# Altium schematic sheet Vertap_IMU.SchDoc: IMU
size A4; Author: Taim Al-Dabbagh; DrawnBy: Taim Al-Dabbagh; Revision: v1; SheetNumber: 3; SheetTotal: 6
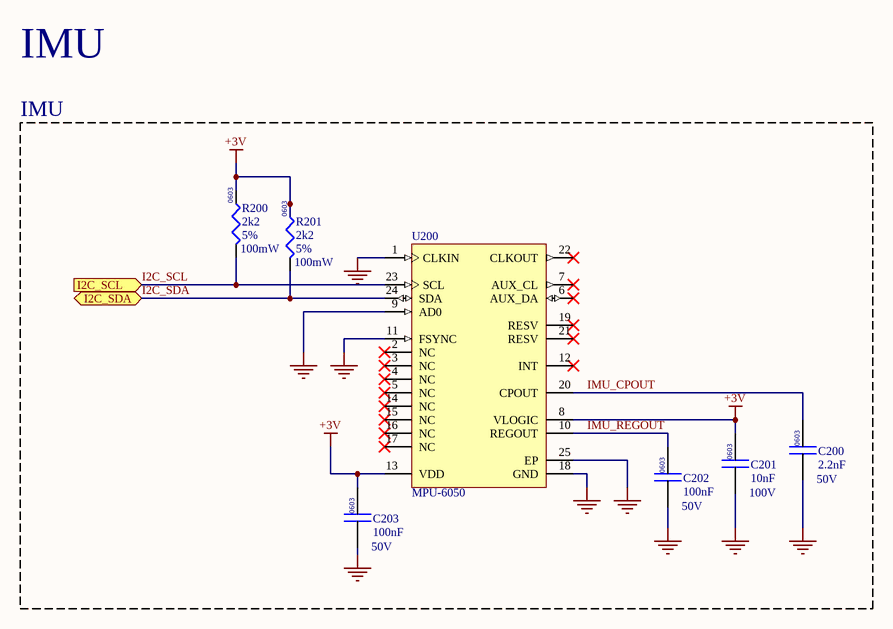
[diagram p0: Vertap_IMU.SchDoc]

## Parts
C200  2.2nF  [CAP_0603_MURATA]
C201  10nF  [CAP_0603_MURATA]
C202  100nF  [CAP_0603_MURATA]
C203  100nF  [CAP_0603_MURATA]
R200  2k2  [RES_0603_YAGEO]
R201  2k2  [RES_0603_YAGEO]
U200  MPU-6050  [IS-QFN-24_V]

## Ports
I2C_SCL (in), I2C_SDA (bidir)

## Nets
+3V: C201.1 C203.1 R200.1 R201.1 U200.8(VLOGIC) U200.13(VDD)
GND: C200.2 C201.2 C202.2 C203.2 U200.1(CLKIN) U200.9(AD0) U200.11(FSYNC) U200.18(GND) U200.25(EP)
I2C_SCL: R200.2 U200.23(SCL) ; port I2C_SCL
I2C_SDA: R201.2 U200.24(SDA) ; port I2C_SDA
IMU_CPOUT: C200.1 U200.20(CPOUT)
IMU_REGOUT: C202.1 U200.10(REGOUT)

Not connected (* = marked no-connect by the designer): U200 2(NC)* 3(NC)* 4(NC)* 5(NC)* 6(AUX_DA)* 7(AUX_CL)* 12(INT)* 14(NC)* 15(NC)* 16(NC)* 17(NC)* 19(RESV)* 21(RESV)* 22(CLKOUT)*

## Notes on the sheet
- IMU
- (near R200) 0603
- (near R200) 5%
- (near R201) 0603
- (near R200) 100mW
- (near R201) 100mW
- (near R201) 5%
- (near C200) 0603
- (near C203) 0603
- (near C202) 0603
- (near C202) 50V
- (near C201) 0603
- (near C201) 100V
- (near C200) 50V
- (near C203) 50V

## Library data of the parts
C200 = CAP_2.2nF_0603: 2200 pF ±20% 50V Ceramic Capacitor X7R 0603 (1608 Metric); Supplier 1: Mouser; Supplier Part Number 1: 81-GCD188R71H222MA1D
C201 = CAP_10nF_0603: CAP CER 10000PF 100V X7R 0603; Supplier 1: Arrow Electronics; Supplier Part Number 1: GCM188R72A103KA37J
C202 C203 = CAP_0.1uF_0603: CAP CER 0.1UF 50V X7R 0603; Supplier 1: Mouser; Supplier Part Number 1: 81-GCM188R71H104JA7D
R200 R201 = RES_0603_2.2K: RES 2.2K OHM 5% 1/10W 0603; Manufacturer: YAGEO; Manufacturer Part Number: RC0603JR-072K2L; Supplier 1: Future Electronics; Supplier Part Number 1: 9707183
U200 = CMP-010-00024-1: Analog Circuit, 1 Func, CMOS; Nominal Supply Voltage: 2.5V; Max Supply Voltage: 3.46V; Min Supply Voltage: 2.375V; RoHS Compliant: Yes; Max Operating Temperature: 85°C; Min Operating Temperature: -40°C; Pins: 24; Case/Package: HVQCCN